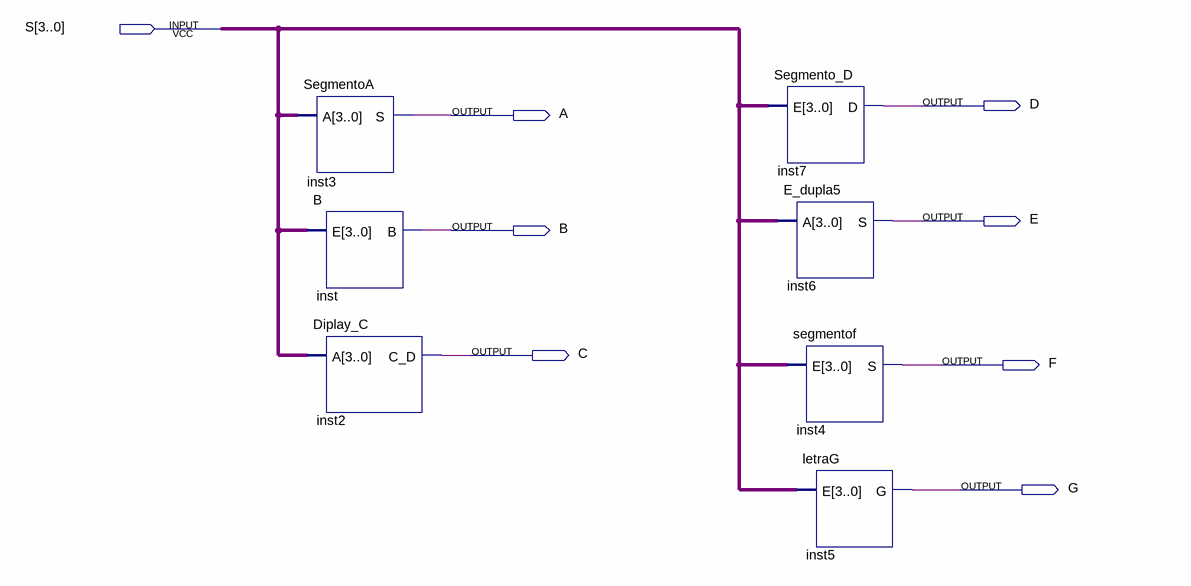
[diagram p0: schematic sheet]
// Quartus schematic display_8seg.bdf as structural Verilog: 7 symbols, 8 pins
module display_8seg (
  input  [3:0] S,
  output D,
  output A,
  output E,
  output B,
  output C,
  output F,
  output G
);

  SegmentoA inst3 (.A(S), .S(A));
  B inst (.E(S), .B(B));
  Diplay_C inst2 (.A(S), .C_D(C));
  Segmento_D inst7 (.E(S), .D(D));
  E_dupla5 inst6 (.A(S), .S(E));
  segmentof inst4 (.E(S), .S(F));
  letraG inst5 (.E(S), .G(G));
endmodule
